# EAGLE design Bracelet v3 (EAGLE 7.6.0)
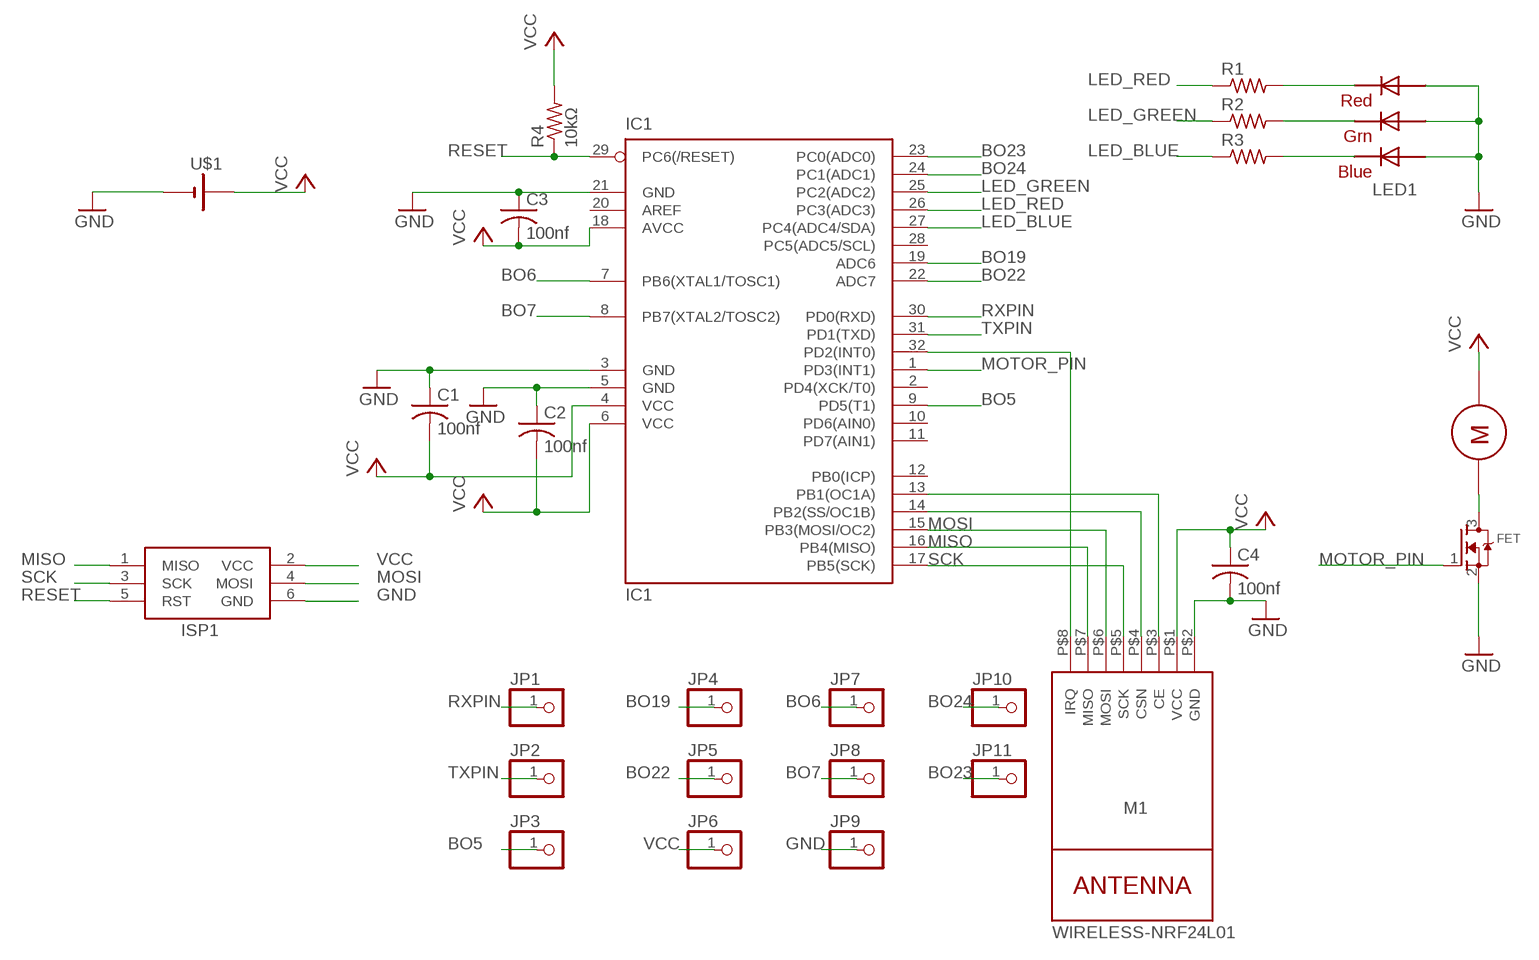
[diagram p0: schematic, sheet 1]

## Parts
C1  100nf  C-USC0805  [C0805]
C2  100nf  C-USC0805  [C0805]
C3  100nf  C-USC0805  [C0805]
C4  100nf  C-USC0805  [C0805]
FET  MOSFET-NREFLOW  [SOT23]
IC1  IC1  MEGA8-AI  [TQFP32-08]
ISP1  AVRISP-6  [AVRISP]
JP1  PINHD-1X1  [1X01]
JP2  PINHD-1X1  [1X01]
JP3  PINHD-1X1  [1X01]
JP4  PINHD-1X1  [1X01]
JP5  PINHD-1X1  [1X01]
JP6  PINHD-1X1  [1X01]
JP7  PINHD-1X1  [1X01]
JP8  PINHD-1X1  [1X01]
JP9  PINHD-1X1  [1X01]
JP10  PINHD-1X1  [1X01]
JP11  PINHD-1X1  [1X01]
LED1  RGBLED5050  [RGBLED5050]
M1  WIRELESS-NRF24L01  [WIRELESS-NRF24L01]
MOTOR  Motor  VIBRATING-MOTOR  [VIBRATING-MOTOR]
R1  R-US_R0805  [R0805]
R2  R-US_R0805  [R0805]
R3  R-US_R0805  [R0805]
R4  10kΩ  R-US_R0805  [R0805]
U$1  CR2032SMT  [CR2032-SMD]

## Nets
BO5: IC1.9(PD5(T1)) JP3.1
BO6: IC1.7(PB6(XTAL1/TOSC1)) JP7.1
BO7: IC1.8(PB7(XTAL2/TOSC2)) JP8.1
BO19: IC1.19(ADC6) JP4.1
BO22: IC1.22(ADC7) JP5.1
BO23: IC1.23(PC0(ADC0)) JP11.1
BO24: IC1.24(PC1(ADC1)) JP10.1
GND: C1.1 C2.1 C3.1 C4.2 FET.2(S) IC1.3(GND) IC1.5(GND) IC1.21(GND) ISP1.6(GND) JP9.1 LED1.1(GREEN_A) LED1.2(RED_A) LED1.3(BLUE_A) M1.P$2(GND) U$1.-$1(-)
LED_BLUE: IC1.27(PC4(ADC4/SDA)) R3.1
LED_GREEN: IC1.25(PC2(ADC2)) R2.1
LED_RED: IC1.26(PC3(ADC3)) R1.1
MISO: IC1.16(PB4(MISO)) ISP1.1(MISO) M1.P$7(MISO)
MOSI: IC1.15(PB3(MOSI/OC2)) ISP1.4(MOSI) M1.P$6(MOSI)
MOTOR_PIN: FET.1(G) IC1.1(PD3(INT1))
N$1: IC1.13(PB1(OC1A)) M1.P$3(CE)
N$2: IC1.14(PB2(SS/OC1B)) M1.P$4(CSN)
N$3: LED1.5(RED_C) R1.2
N$4: LED1.6(GREEN_C) R2.2
N$5: LED1.4(BLUE_C) R3.2
N$6: IC1.32(PD2(INT0)) M1.P$8(IRQ)
N$7: FET.3(D) MOTOR.P$2
RESET: IC1.29(PC6(/RESET)) ISP1.5(RST) R4.1
RXPIN: IC1.30(PD0(RXD)) JP1.1
SCK: IC1.17(PB5(SCK)) ISP1.3(SCK) M1.P$5(SCK)
TXPIN: IC1.31(PD1(TXD)) JP2.1
VCC: C1.2 C2.2 C3.2 C4.1 IC1.4(VCC) IC1.6(VCC) IC1.18(AVCC) ISP1.2(VCC) JP6.1 M1.P$1(VCC) MOTOR.NAME R4.2 U$1.+$1(+1)
Unconnected: IC1.2(PD4(XCK/T0)) IC1.10(PD6(AIN0)) IC1.11(PD7(AIN1)) IC1.12(PB0(ICP)) IC1.20(AREF) IC1.28(PC5(ADC5/SCL))

## Library data of the parts
C1 C3 = resistor:C-US: CAPACITOR, American symbol
C2 C4 = rcl:C-US: CAPACITOR, American symbol
FET = adafruit:MOSFET-N: N-Channel Mosfet 2N7002E - 60V 260mA SOT23 [Digikey: 2N7002ET1GOSTR-ND] - REEL BSH103 - 30V 850mA SOT23 [Digikey: 568-5013-1-ND]
IC1 = atmel:MEGA8: MICROCONTROLLER 8 Kbytes FLASH, 1 kbytes SRAM, 512 bytes EEPROM, USART, 6-channel 10 bit ADC, 2-channel 8 bit ADC Pin compatible with Atmega48, ATMega88, ATMega168 Source: avr.lbr; MPN: ATMEGA8-16AU; OC_FARNELL: 9171371; OC_NEWARK: 73M8863
ISP1 = adafruit:AVRISP: AVR ISP HEADER Standard 6 pin header for AVR programming
JP1-JP11 = pinhead:PINHD-1X1: PIN HEADER
LED1 = adafruit:RGBLED: For 5050 RGB LEDs, the order of the LEDs may vary from one manufacturer to another!
M1 = Alex's Library:WIRELESS-NRF24L01: 2.4 GHz Wireless Module based on NRF24L01 chip
MOTOR = Alex's Library:VIBRATING-MOTOR
R1-R4 = adafruit:R-US_: RESISTOR, American symbol
U$1 = LIB2:CR2032

## Board
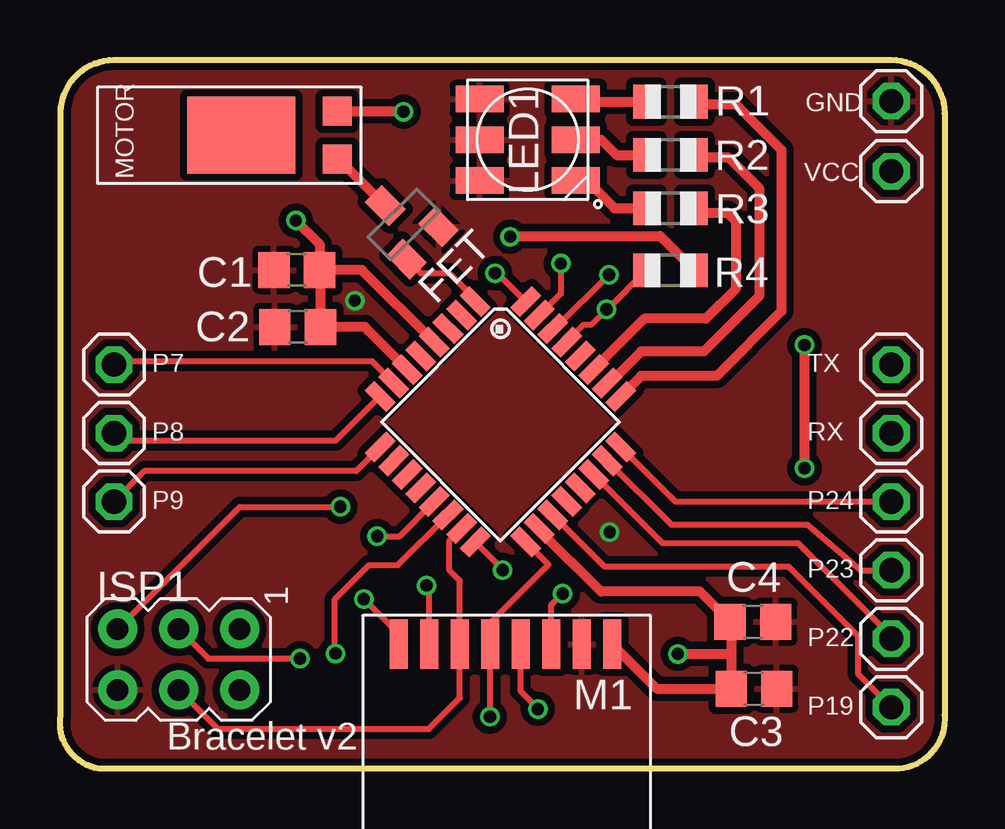
[diagram p1: board, top side]
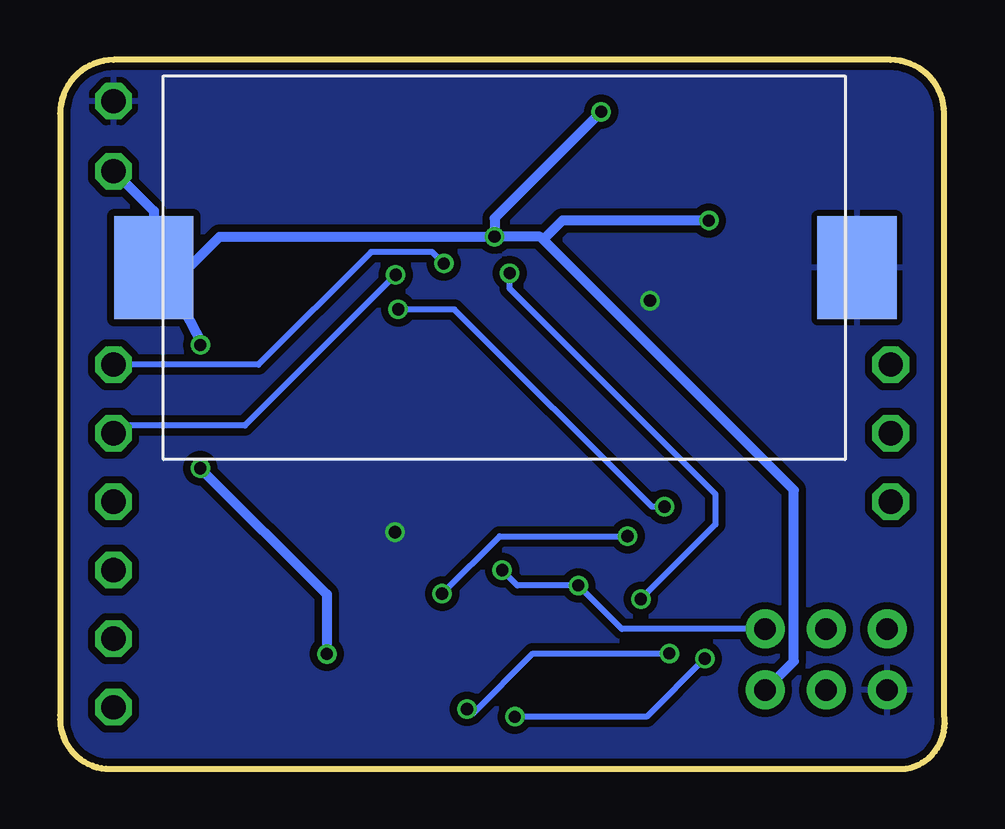
[diagram p2: board, bottom side, seen from below]

Size 36.86 x 29.55 mm. Coordinates in mm from the lower left corner, seen from the top.
Outline: 36.86,27.33 36.86,2.24 arc-90 34.95,0 1.62,0 arc-90 0.03,2.24 0.03,27.33 arc-90 2.25,29.55 34.64,29.55 arc-90 36.86,27.33
Copper layers (1*16): Top 0.035mm / dielectric 1.5mm / Bottom 0.035mm
Design rules "MakerStudio": minimum track width 6mil, minimum drill 12mil, track to track 6mil, track to pad 6mil, pad to pad 6mil, via to via 6mil, smd to smd 0mil, copper to edge 10mil, drill to drill 10mil, minimum pad ring 10mil, minimum via ring 6mil, stop-mask expansion 2mil, vias tented up to drill 100mil, thermal gap 10mil

### Footprints (pad centres in the part's own frame; a part is rotated, then mirrored left to right if it is on the bottom)
C0805 = smd 1.3 x 1.5: 1 -0.95,0; 2 0.95,0
SOT23 = smd 1 x 1.4: 1 -0.95,-1.1; 2 0.95,-1.1; 3 0,1.1
TQFP32-08 = smd 1.27 x 0.559: 1 -4.293,2.8; 2 -4.293,2; 3 -4.293,1.2; 4 -4.293,0.4; 5 -4.293,-0.4; 6 -4.293,-1.2; 7 -4.293,-2; 8 -4.293,-2.8; 17 4.293,-2.8; 18 4.293,-2; 19 4.293,-1.2; 20 4.293,-0.4; 21 4.293,0.4; 22 4.293,1.2; 23 4.293,2; 24 4.293,2.8 | smd 0.559 x 1.27: 9 -2.8,-4.293; 10 -2,-4.293; 11 -1.2,-4.293; 12 -0.4,-4.293; 13 0.4,-4.293; 14 1.2,-4.293; 15 2,-4.293; 16 2.8,-4.293; 25 2.8,4.293; 26 2,4.293; 27 1.2,4.293; 28 0.4,4.293; 29 -0.4,4.293; 30 -1.2,4.293; 31 -2,4.293; 32 -2.8,4.293
AVRISP = drill 0.9 pad 1.626: 1 -1.27,2.54; 2 1.27,2.54; 3 -1.27,0; 4 1.27,0; 5 -1.27,-2.54; 6 1.27,-2.54
1X01 = drill 1.016 octagon: 1 0,0
RGBLED5050 = smd 2 x 1.1: 1 -2,1.7; 2 -2,0; 3 -2,-1.7; 4 2,-1.7; 5 2,0; 6 2,1.7
WIRELESS-NRF24L01 = smd 0.76 x 2.05: P$1 -4.4,-7.8; P$2 -3.13,-7.8; P$3 -1.86,-7.8; P$4 -0.59,-7.8; P$5 0.68,-7.8; P$6 1.95,-7.8; P$7 3.22,-7.8; P$8 4.49,-7.8
VIBRATING-MOTOR = smd 1.2 x 1.2: NAME -1,6.5; P$2 1,6.5 | smd 3.2 x 4.5: P$5 0,2.5
R0805 = smd 1.1 x 1.4: 1 -1,0; 2 1,0
CR2032-SMD = smd 3.3 x 4.3: +$1 -14.6,0; -$1 14.7,0

### Placement (x,y rotation side)
C1  9.86,20.8 0 top
C2  9.9,18.42 0 top
C3  28.92,3.33 180 top
C4  28.87,6.13 0 top
FET  14.33,22.7 45 top
IC1  18.35,14.46 315 top
ISP1  4.94,4.56 270 top
JP1  34.64,13.99 0 top
JP2  34.64,16.85 0 top
JP3  2.25,11.13 0 top
JP4  34.64,2.56 0 top
JP5  34.64,5.42 0 top
JP6  34.64,24.91 0 top
JP7  2.25,16.85 0 top
JP8  2.25,13.99 0 top
JP9  34.64,27.83 0 top
JP10  34.64,11.13 0 top
JP11  34.64,8.28 0 top
LED1  19.48,26.22 0 top
M1  18.61,-2.61 180 top
MOTOR  5.05,26.41 270 top
R1  25.43,25.59 180 top
R2  25.43,27.81 180 top
R3  25.43,23.36 180 top
R4  25.43,20.79 0 top
U$1  18.35,20.89 0 bottom

### Tracks (layer width: path | path; a pad name or v marks a point on that pad's centre or on a via)
BO5
  Top 0.254: IC1.9 12.34,12.4 3.52,12.4 JP3.1
BO6
  Top 0.254: JP7.1 2.71,16.99 13.02,16.99 13.02,16.97 IC1.7
BO7
  Top 0.254: JP8.1 2.26,13.68 11.48,13.68 13.32,15.52 IC1.8
BO19
  Top 0.254: IC1.19 22.69,8.43 30.35,8.43 33.24,5.54 33.24,3.96 JP4.1
BO22
  Top 0.254: IC1.22 25.1,9.41 30.73,9.41 34.23,5.91 JP5.1
BO23
  Top 0.254: IC1.23 25.46,10.18 31.14,10.18 33.37,8.28 JP11.1
BO24
  Top 0.254: IC1.24 25.64,11.13 JP10.1
GND  (via drill 0.51)
  other vias: 12.28,19.52 22.9,9.86
  pour Top (isolate 0.305): 0.35,28.28 arc-90 1.62,29.55 35.91,29.55 arc-90 37.18,28.28 37.18,1.61 arc-90 35.91,0.34 1.62,0.34 arc-90 0.35,1.61
  pour Bottom (isolate 0.305): 37.18,1.61 arc-90 35.91,0.34 1.62,0.34 arc-90 0.35,1.61 0.35,28.28 arc-90 1.62,29.55 35.91,29.55 arc-90 37.18,28.28
LED_BLUE
  Top 0.406: R3.1 26.61,23.19 27.8,23.19 28.15,22.84 28.15,20.01 26.91,18.77 24.35,18.77 IC1.27
LED_GREEN
  Top 0.406: R2.1 26.54,27.7 28.15,27.7 30.05,25.8 30.05,19.08 27.36,16.38 24.22,16.38 23.37,15.53 IC1.25
LED_RED
  Top 0.406: R1.1 26.53,25.49 27.84,25.49 29.13,24.21 29.13,19.7 26.83,17.4 24.22,17.4 22.9,16.08 IC1.26
MISO  (via drill 0.51)
  Top 0.254: 17.26,9.41 IC1.16 18.44,8.3 v18.44,8.28 | M1.P$7 15.39,7.52 v15.27,7.64
  Bottom 0.254: v18.44,8.28 17.81,7.64 v15.27,7.64 13.45,5.83 ISP1.1
MOSI
  Top 0.254: IC1.15 16.22,9.5 16.22,8.28 16.66,7.84 M1.P$6 16.66,2.95 15.37,1.66 6.57,1.66 ISP1.4
MOTOR_PIN
  Top 0.254: FET.1 15.02,20.66 16.22,20.66 17.3,19.58 IC1.1
N$1  (via drill 0.51)
  Top 0.254: 15.59,11.12 IC1.13 14.15,9.69 v13.22,9.69 | M1.P$3 20.47,6.82 v20.94,7.3
  Bottom 0.254: v13.22,9.69 18.55,9.69 v20.94,7.3
N$2  (via drill 0.51)
  Top 0.254: IC1.14 14.08,8.49 12.88,8.49 11.46,7.07 11.46,4.83 v11.48,4.81 | M1.P$4 19.18,5.17 19.18,3.24 19.91,2.51 v19.91,2.49
  Bottom 0.254: v19.91,2.49 19.69,2.28 17.16,4.81 v11.48,4.81
N$3
  Top 0.406: LED1.5 22.56,26.22 23.2,25.58 R1.2
N$4
  Top 0.254: LED1.6 20.96,27.81
  Top 0.406: 20.96,27.81 R2.2
N$5
  Top 0.406: LED1.4 21.96,24.52 23.11,23.37 R3.2
N$6  (via drill 0.51)
  Top 0.254: v18.13,20.66 18.23,20.66 IC1.32 | M1.P$8 14.12,5.62 v12.66,7.07
  Bottom 0.254: v18.13,20.66 18.13,20.02 9.55,11.45 9.55,10.18 v12.66,7.07 | v12.66,7.07
N$7
  Top 0.406: MOTOR.P$2 11.61,25.41 FET.3
RESET  (via drill 0.51)
  Top 0.254: 21.11,17.87 IC1.29 21.11,17.8 21.81,18.5 22.12,18.5 v22.77,19.15 22.8,19.15 R4.1 | ISP1.5 7.5,10.92 v11.68,10.92
  Bottom 0.254: v22.77,19.15 20.43,19.15 12.2,10.92 v11.68,10.92
RXPIN  (via drill 0.51)
  Top 0.254: v22.88,20.59 20.61,18.35 IC1.30
  Bottom 0.254: v22.88,20.59 29.16,14.31 34.32,14.31 JP1.1
SCK  (via drill 0.51)
  Top 0.254: IC1.17 20.35,8.51 20.35,8.5 17.93,6.08 M1.P$5 17.93,2.18 v17.91,2.17 | ISP1.3 6.18,4.59 v10,4.59
  Bottom 0.254: v10,4.59 12.42,2.17 v17.91,2.17
TXPIN  (via drill 0.51)
  Top 0.254: 19.98,18.99 IC1.31 20.87,19.81 v20.87,21.06
  Bottom 0.254: v20.87,21.06 21.36,21.55 23.91,21.55 28.6,16.85 JP2.1
VCC  (via drill 0.51)
  Top 0.254: C3.2 27.94,3.36 | 19.98,9.94 IC1.18 | C4.1 27.97,6.08
  Top 0.406: C4.1 26.66,7.39 22.53,7.39 19.98,9.94 | 27.97,6.08 27.97,4.78 | 27.97,4.78 C3.2 24.87,3.33 M1.P$1 | v9.83,22.85 10.81,21.87 C1.2 | C1.2 10.85,20.76 C2.2 12.7,18.42 IC1.6 | IC1.4 12.58,20.8 C1.2 | R4.2 25.01,22.21 18.79,22.21 v18.76,22.18 18.73,22.21 | v31.02,17.67 v31.02,12.53 | v25.75,4.78 27.97,4.78 | MOTOR.NAME 14.3,27.41 v14.32,27.39
  Bottom 0.406: 32.23,20.17 U$1.+$1 32.95,23.25 JP6.1 | 32.23,20.17 30.96,17.73 v31.02,17.67 | v31.02,17.67 | 32.23,20.17 30.22,22.18 v18.76,22.18 | ISP1.2 6.29,4.48 6.29,11.62 16.73,22.06 | v31.02,12.53 25.75,7.28 v25.75,4.78 | v14.32,27.39 18.76,22.95 v18.76,22.18 | 16.73,22.06 16.86,22.18 v18.76,22.18 | v9.83,22.85 15.93,22.85 16.73,22.06

### Text on the board
tNames: GND | MOTOR | VCC | . | P7 | TX | P8 | RX | P9 | P24 | P23 | P22 | Bracelet v2 | P19